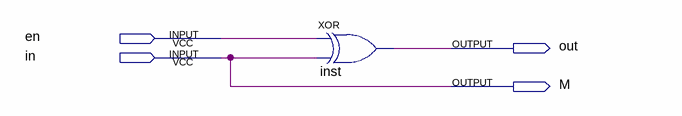
[diagram p0: schematic sheet]
// Quartus schematic nested_counter_1b.bdf as structural Verilog: 1 symbols, 4 pins
module nested_counter_1b (
  input  en,
  input  in,
  output out,
  output M
);

  xor inst (out, en, in);

  assign M = in;
endmodule
